# Altium project PCB2_Middle.PrjPcb
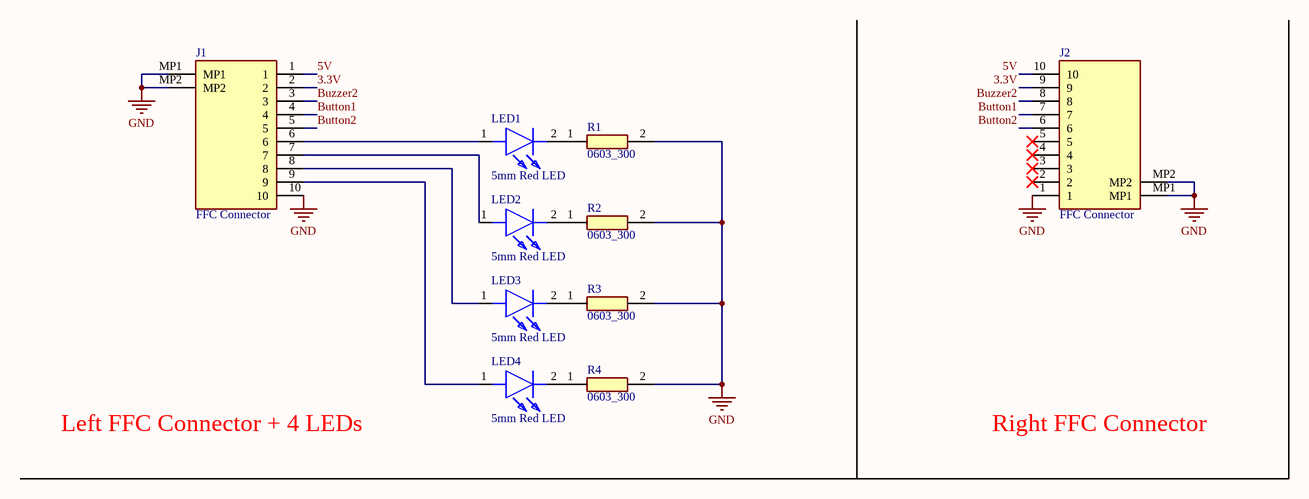
[diagram p0: LED Board.SchDoc]
1 sheet, 10 parts. Net scope: global (net labels, ports and power ports of the same name join across sheets).
Board file: PCB2_Middle.PcbDoc

## Sheet LED Board.SchDoc
size A4

### Parts
J1  FFC Connector  [528921033]
J2  FFC Connector  [528921033]
LED1  5mm Red LED  [TLHR_6400]
LED2  5mm Red LED  [TLHR_6400]
LED3  5mm Red LED  [TLHR_6400]
LED4  5mm Red LED  [TLHR_6400]
R1  0603_300  [ERA3KV_(0603)]
R2  0603_300  [ERA3KV_(0603)]
R3  0603_300  [ERA3KV_(0603)]
R4  0603_300  [ERA3KV_(0603)]

### Nets
GND: J1.10 J1.MP1 J1.MP2 J2.1 J2.MP1 J2.MP2 R1.2 R2.2 R3.2 R4.2
3.3V: J1.2 J2.9
5V: J1.1 J2.10
Button1: J1.4 J2.7
Button2: J1.5 J2.6
Buzzer2: J1.3 J2.8
NetJ1_6: J1.6 LED1.1(A)
NetJ1_7: J1.7 LED2.1(A)
NetJ1_8: J1.8 LED3.1(A)
NetJ1_9: J1.9 LED4.1(A)
NetLED1_2: LED1.2(K) R1.1
NetLED2_2: LED2.2(K) R2.1
NetLED3_2: LED3.2(K) R3.1
NetLED4_2: LED4.2(K) R4.1

Not connected (* = marked no-connect by the designer): J2 2* 3* 4* 5*

### Notes on the sheet
- Left FFC Connector + 4 LEDs
- Right FFC Connector

### Library data of the parts
J1 J2 = FFC Connector: Connector; Manufacturer_Name: Molex; Manufacturer_Part_Number: 52892-1033; Datasheet Link: https://componentsearchengine.com/Datasheets/2/52892-1033.pdf; Height: 2mm
LED1-LED4 = TLHR6400: LED; Manufacturer_Name: Vishay; Datasheet Link: https://www.vishay.com/docs/83219/tlhg640.pdf; Manufacturer_Part_Number: TLHR6400
R1-R4 = 0603_R: Resistor; Manufacturer_Name: Panasonic; Manufacturer_Part_Number: ERA-3KEB2403V; Datasheet Link: http://industrial.panasonic.com/cdbs/www-data/pdf/RDM0000/RDM0000C331.pdf; Height: 0.4mm